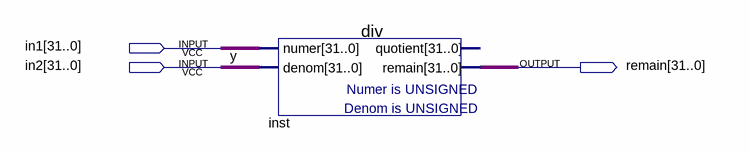
[diagram p0: schematic sheet]
// Quartus schematic mod.bdf as structural Verilog: 1 symbols, 3 pins
module mod (
  input  [31:0] in1,
  input  [31:0] in2,
  output [31:0] remain
);

  wire y;

  div inst (.numer(in1), .denom({32{y}}), .remain(remain));  // open: quotient
endmodule
